# EAGLE schematic 4x1button_msp430 v5 (EAGLE 9.7.0)

## Sheet 1 of 6
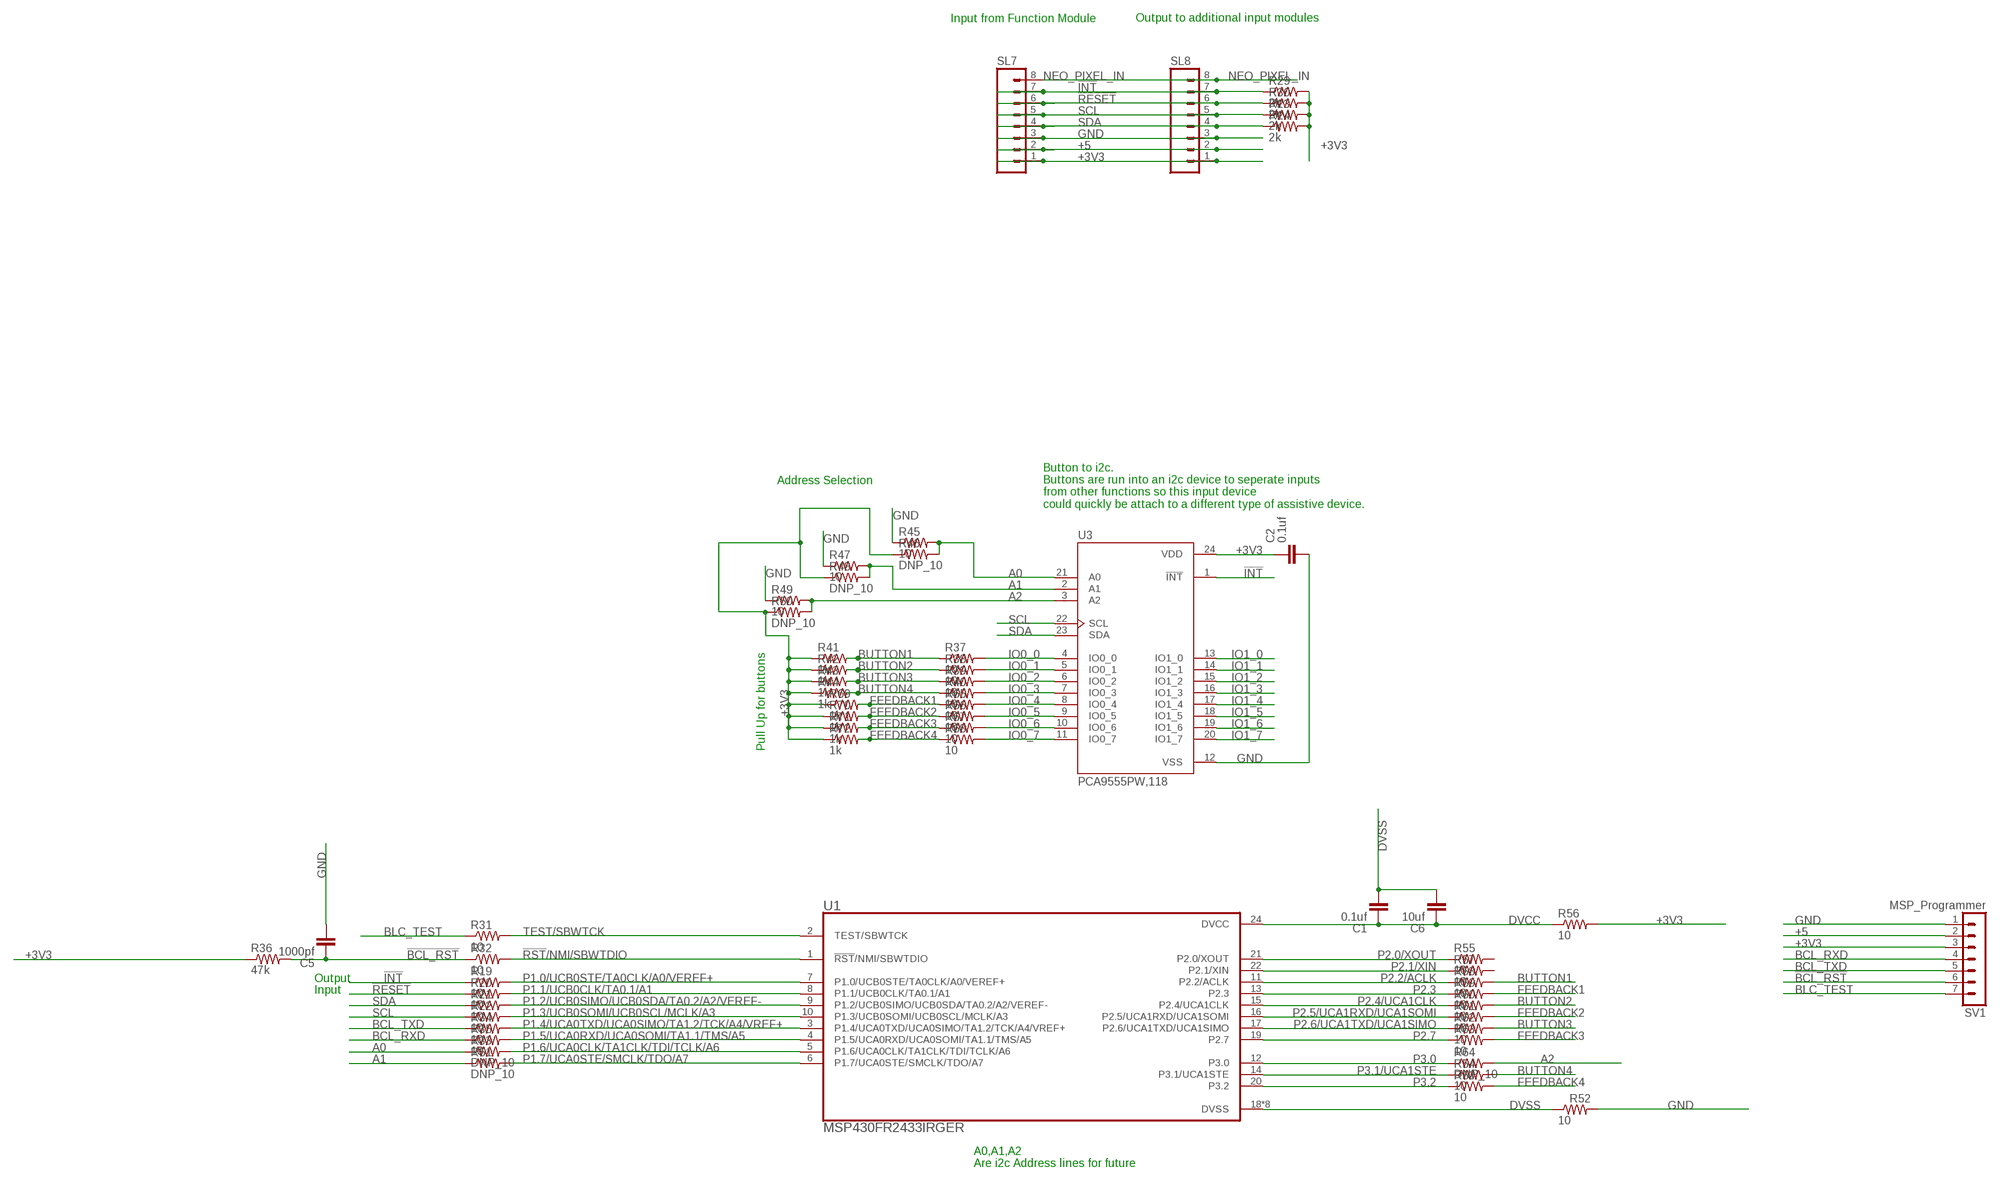
[diagram p0: schematic, sheet 1]

### Parts
C1  0.1uf  C_CHIP-0805(2012-METRIC)  [CAPC2012X110]
C2  0.1uf  C_CHIP-0805(2012-METRIC)  [CAPC2012X110]
C5  1000pf  C_CHIP-0805(2012-METRIC)  [CAPC2012X110]
C6  10uf  C_CHIP-0805(2012-METRIC)  [CAPC2012X110]
R19  10  R-US_R0805  [R0805]
R20  10  R-US_R0805  [R0805]
R21  10  R-US_R0805  [R0805]
R22  10  R-US_R0805  [R0805]
R23  2k  R-US_R0805  [R0805]
R24  2k  R-US_R0805  [R0805]
R29  2k  R-US_R0805  [R0805]
R30  2k  R-US_R0805  [R0805]
R31  10  R-US_R0805  [R0805]
R32  10  R-US_R0805  [R0805]
R33  DNP_10  R-US_R0805  [R0805]
R34  10  R-US_R0805  [R0805]
R35  10  R-US_R0805  [R0805]
R36  47k  R-US_R0805  [R0805]
R37  10  R-US_R0805  [R0805]
R38  10  R-US_R0805  [R0805]
R39  10  R-US_R0805  [R0805]
R40  10  R-US_R0805  [R0805]
R41  1k  R-US_R0805  [R0805]
R42  1k  R-US_R0805  [R0805]
R43  1k  R-US_R0805  [R0805]
R44  1k  R-US_R0805  [R0805]
R45  10  R-US_R0805  [R0805]
R46  DNP_10  R-US_R0805  [R0805]
R47  10  R-US_R0805  [R0805]
R48  DNP_10  R-US_R0805  [R0805]
R49  10  R-US_R0805  [R0805]
R50  DNP_10  R-US_R0805  [R0805]
R51  DNP_10  R-US_R0805  [R0805]
R52  10  R-US_R0805  [R0805]
R53  10  R-US_R0805  [R0805]
R54  10  R-US_R0805  [R0805]
R55  10  R-US_R0805  [R0805]
R56  10  R-US_R0805  [R0805]
R57  10  R-US_R0805  [R0805]
R58  10  R-US_R0805  [R0805]
R59  10  R-US_R0805  [R0805]
R60  10  R-US_R0805  [R0805]
R61  10  R-US_R0805  [R0805]
R62  10  R-US_R0805  [R0805]
R63  10  R-US_R0805  [R0805]
R64  DNP_10  R-US_R0805  [R0805]
R65  10  R-US_R0805  [R0805]
R66  10  R-US_R0805  [R0805]
R67  10  R-US_R0805  [R0805]
R68  10  R-US_R0805  [R0805]
R69  1k  R-US_R0805  [R0805]
R70  1k  R-US_R0805  [R0805]
R71  1k  R-US_R0805  [R0805]
R72  1k  R-US_R0805  [R0805]
SL7  MA08  [08PA]
SL8  MA08  [08PA]
SV1  MSP_Programmer  MA07-1  [MA07-1]
U1  MSP430FR2433IRGER  [QFN50P400X400X100-25N]
U3  PCA9555PW,118  [SOP65P640X110-24N]

### Nets
!BCL_RST: C5.1 R32.1 R36.2 SV1.6
!INT: R19.1 R29.1 SL7.7 SL8.7 U3.1(!INT)
!RESET: R20.1 R30.1 SL7.6 SL8.6
!RST!/NMI/SBWTDIO: R32.2 U1.1(!RST!/NMI/SBWTDIO)
+3V3: C2.1 R23.2 R24.2 R29.2 R30.2 R36.1 R41.1 R42.1 R43.1 R44.1 R46.1 R48.1 R50.1 R56.2 R69.1 R70.1 R71.1 R72.1 SL7.1 SL8.1 SV1.3 U3.24(VDD) ; also sheet 2,3,4,5,6
+5: SL7.2 SL8.2 SV1.2 ; also sheet 2,3,4,5,6
A0: R33.1 R45.2 R46.2 U3.21(A0)
A1: R47.2 R48.2 R51.1 U3.2(A1)
A2: R49.2 R50.2 R64.2 U3.3(A2)
BCL_RXD: R35.1 SV1.4
BCL_TXD: R34.1 SV1.5
BLC_TEST: R31.1 SV1.7
BUTTON1: R37.1 R41.2 R58.2 ; also sheet 2
BUTTON2: R38.1 R42.2 R60.2 ; also sheet 3
BUTTON3: R39.1 R43.2 R62.2 ; also sheet 4
BUTTON4: R40.1 R44.2 R54.2 ; also sheet 5
DVCC: C1.1 C6.1 R56.1 U1.24(DVCC)
DVSS: C1.2 C6.2 R52.1 U1.18(DVSS) U1.23(DVSS) U1.25(DVSS) U1.26(DVSS) U1.27(DVSS) U1.28(DVSS) U1.29(DVSS) U1.30(DVSS)
FEEDBACK1: R59.2 R65.1 R69.2 ; also sheet 2
FEEDBACK2: R61.2 R66.1 R70.2 ; also sheet 3
FEEDBACK3: R63.2 R67.1 R71.2 ; also sheet 4
FEEDBACK4: R53.2 R68.1 R72.2 ; also sheet 5
GND: C2.2 C5.2 R45.1 R47.1 R49.1 R52.2 SL7.3 SL8.3 SV1.1 U3.12(VSS) ; also sheet 2,3,4,5,6
IO0_0: R37.2 U3.4(IO0_0)
IO0_1: R38.2 U3.5(IO0_1)
IO0_2: R39.2 U3.6(IO0_2)
IO0_3: R40.2 U3.7(IO0_3)
IO0_4: R65.2 U3.8(IO0_4)
IO0_5: R66.2 U3.9(IO0_5)
IO0_6: R67.2 U3.10(IO0_6)
IO0_7: R68.2 U3.11(IO0_7)
IO1_0: U3.13(IO1_0)
IO1_1: U3.14(IO1_1)
IO1_2: U3.15(IO1_2)
IO1_3: U3.16(IO1_3)
IO1_4: U3.17(IO1_4)
IO1_5: U3.18(IO1_5)
IO1_6: U3.19(IO1_6)
IO1_7: U3.20(IO1_7)
NEO_PIXEL_IN: SL7.8 SL8.8 ; also sheet 2
P1.0/UCB0STE/TA0CLK/A0/VEREF+: R19.2 U1.7(P1.0/UCB0STE/TA0CLK/A0/VEREF+)
P1.1/UCB0CLK/TA0.1/A1: R20.2 U1.8(P1.1/UCB0CLK/TA0.1/A1)
P1.2/UCB0SIMO/UCB0SDA/TA0.2/A2/VEREF-: R21.2 U1.9(P1.2/UCB0SIMO/UCB0SDA/TA0.2/A2/VEREF-)
P1.3/UCB0SOMI/UCB0SCL/MCLK/A3: R22.2 U1.10(P1.3/UCB0SOMI/UCB0SCL/MCLK/A3)
P1.4/UCA0TXD/UCA0SIMO/TA1.2/TCK/A4/VREF+: R34.2 U1.3(P1.4/UCA0TXD/UCA0SIMO/TA1.2/TCK/A4/VREF+)
P1.5/UCA0RXD/UCA0SOMI/TA1.1/TMS/A5: R35.2 U1.4(P1.5/UCA0RXD/UCA0SOMI/TA1.1/TMS/A5)
P1.6/UCA0CLK/TA1CLK/TDI/TCLK/A6: R33.2 U1.5(P1.6/UCA0CLK/TA1CLK/TDI/TCLK/A6)
P1.7/UCA0STE/SMCLK/TDO/A7: R51.2 U1.6(P1.7/UCA0STE/SMCLK/TDO/A7)
P2.0/XOUT: R55.1 U1.21(P2.0/XOUT)
P2.1/XIN: R57.1 U1.22(P2.1/XIN)
P2.2/ACLK: R58.1 U1.11(P2.2/ACLK)
P2.3: R59.1 U1.13(P2.3)
P2.4/UCA1CLK: R60.1 U1.15(P2.4/UCA1CLK)
P2.5/UCA1RXD/UCA1SOMI: R61.1 U1.16(P2.5/UCA1RXD/UCA1SOMI)
P2.6/UCA1TXD/UCA1SIMO: R62.1 U1.17(P2.6/UCA1TXD/UCA1SIMO)
P2.7: R63.1 U1.19(P2.7)
P3.0: R64.1 U1.12(P3.0)
P3.1/UCA1STE: R54.1 U1.14(P3.1/UCA1STE)
P3.2: R53.1 U1.20(P3.2)
SCL: R22.1 R23.1 SL7.5 SL8.5 U3.22(SCL)
SDA: R21.1 R24.1 SL7.4 SL8.4 U3.23(SDA)
TEST/SBWTCK: R31.2 U1.2(TEST/SBWTCK)
Unconnected: R55.2 R57.2

### Notes on the sheet
- Input from Function Module
- Output to additional input modules
- Address Selection
- Button to i2c.
  Buttons are run into an i2c device to seperate inputs 
  from other functions so this input device 
  could quickly be attach to a different type of assistive device.
- Pull Up for buttons
- Output
- Input
- A0,A1,A2
  Are i2c Address lines for future

## Sheet 2 of 6
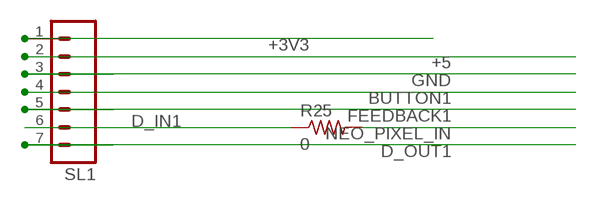
[diagram p1: schematic, sheet 2]

### Parts
R25  0  R-US_R0805  [R0805]
SL1  MA07  [07PA]

### Nets
+3V3: SL1.1 ; also sheet 1,3,4,5,6
+5: SL1.2 ; also sheet 1,3,4,5,6
BUTTON1: SL1.4 ; also sheet 1
D_IN1: R25.1 SL1.6
D_OUT1: SL1.7 ; also sheet 3
FEEDBACK1: SL1.5 ; also sheet 1
GND: SL1.3 ; also sheet 1,3,4,5,6
NEO_PIXEL_IN: R25.2 ; also sheet 1

## Sheet 3 of 6
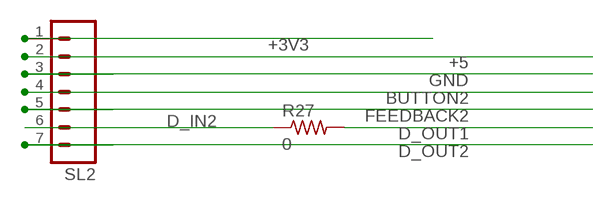
[diagram p2: schematic, sheet 3]

### Parts
R27  0  R-US_R0805  [R0805]
SL2  MA07  [07PA]

### Nets
+3V3: SL2.1 ; also sheet 1,2,4,5,6
+5: SL2.2 ; also sheet 1,2,4,5,6
BUTTON2: SL2.4 ; also sheet 1
D_IN2: R27.1 SL2.6
D_OUT1: R27.2 ; also sheet 2
D_OUT2: SL2.7 ; also sheet 4
FEEDBACK2: SL2.5 ; also sheet 1
GND: SL2.3 ; also sheet 1,2,4,5,6

## Sheet 4 of 6
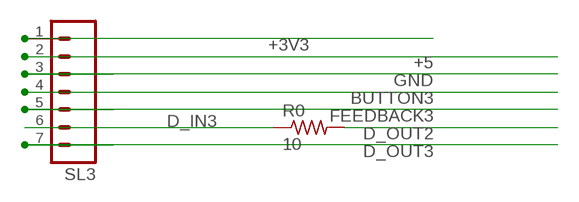
[diagram p3: schematic, sheet 4]

### Parts
R0  10  R-US_R0805  [R0805]
SL3  MA07  [07PA]

### Nets
+3V3: SL3.1 ; also sheet 1,2,3,5,6
+5: SL3.2 ; also sheet 1,2,3,5,6
BUTTON3: SL3.4 ; also sheet 1
D_IN3: R0.1 SL3.6
D_OUT2: R0.2 ; also sheet 3
D_OUT3: SL3.7 ; also sheet 5
FEEDBACK3: SL3.5 ; also sheet 1
GND: SL3.3 ; also sheet 1,2,3,5,6

## Sheet 5 of 6
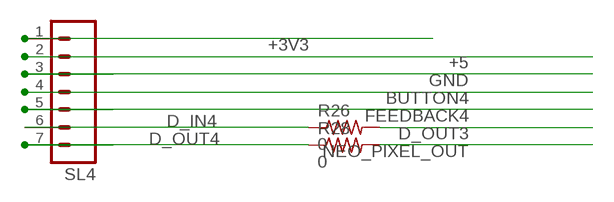
[diagram p4: schematic, sheet 5]

### Parts
R26  0  R-US_R0805  [R0805]
R28  0  R-US_R0805  [R0805]
SL4  MA07  [07PA]

### Nets
+3V3: SL4.1 ; also sheet 1,2,3,4,6
+5: SL4.2 ; also sheet 1,2,3,4,6
BUTTON4: SL4.4 ; also sheet 1
D_IN4: R26.1 SL4.6
D_OUT3: R26.2 ; also sheet 4
D_OUT4: R28.1 SL4.7
FEEDBACK4: SL4.5 ; also sheet 1
GND: SL4.3 ; also sheet 1,2,3,4,6
NEO_PIXEL_OUT: R28.2

## Sheet 6 of 6
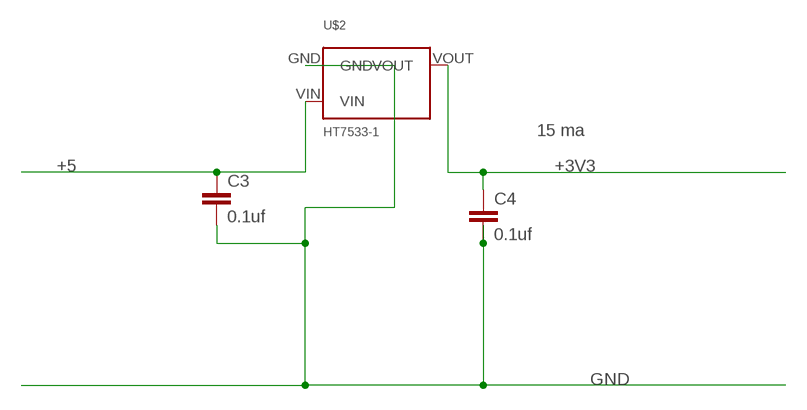
[diagram p5: schematic, sheet 6]

### Parts
C3  0.1uf  C-EUC0805  [C0805]
C4  0.1uf  C-EUC0805  [C0805]
U$2  HT7533-1  HT7550-1  [HT7750-1]

### Nets
+3V3: C4.1 U$2.VOUT ; also sheet 1,2,3,4,5
+5: C3.1 U$2.VIN ; also sheet 1,2,3,4,5
GND: C3.2 C4.2 U$2.GND ; also sheet 1,2,3,4,5

### Notes on the sheet
- 15 ma

## Library data of the parts
C1 C2 C5 C6 = Capacitor:C: Capacitor - Generic; CATEGORY: Capacitor; PACKAGE_SIZE: 0805; PACKAGE_TYPE: SMD; SUBCATEGORY: Ceramic Capacitors; TYPE: MLCC
C3 C4 = resistor:C-EU: CAPACITOR, European symbol; HEIGHT: 1
R0 R19-R72 = adafruit:R-US_: RESISTOR, American symbol
SL1-SL4 = con-amp-quick:MA07: AMP QUICK CONNECTOR; OC_FARNELL: unknown; OC_NEWARK: unknown
SL7 SL8 = con-amp-quick:MA08: AMP QUICK CONNECTOR; OC_FARNELL: unknown; OC_NEWARK: unknown
SV1 = con-lstb:MA07-1: PIN HEADER; OC_FARNELL: unknown; OC_NEWARK: unknown
U1 = MSP430FR2433IRGER:MSP430FR2433IRGER; MANUFACTURER: Texas Instruments; MAXIMUM_PACKAGE_HEIGHT: 1.00 mm; PARTREV: 8/2017; STANDARD: Manufacturer Recommendations
U3 = PCA9555PW_118:PCA9555PW,118; MANUFACTURER: NXP; MAXIMUM_PACKAGE_HEIGHT: 1.1mm; PARTREV: 10; STANDARD: IPC 7351B
U$2 = SOT89_VoltageRgulator:HT7550-1: HT7550-1 Voltage regulator with Center VIN